# EAGLE design helipad (EAGLE 7.2.0)
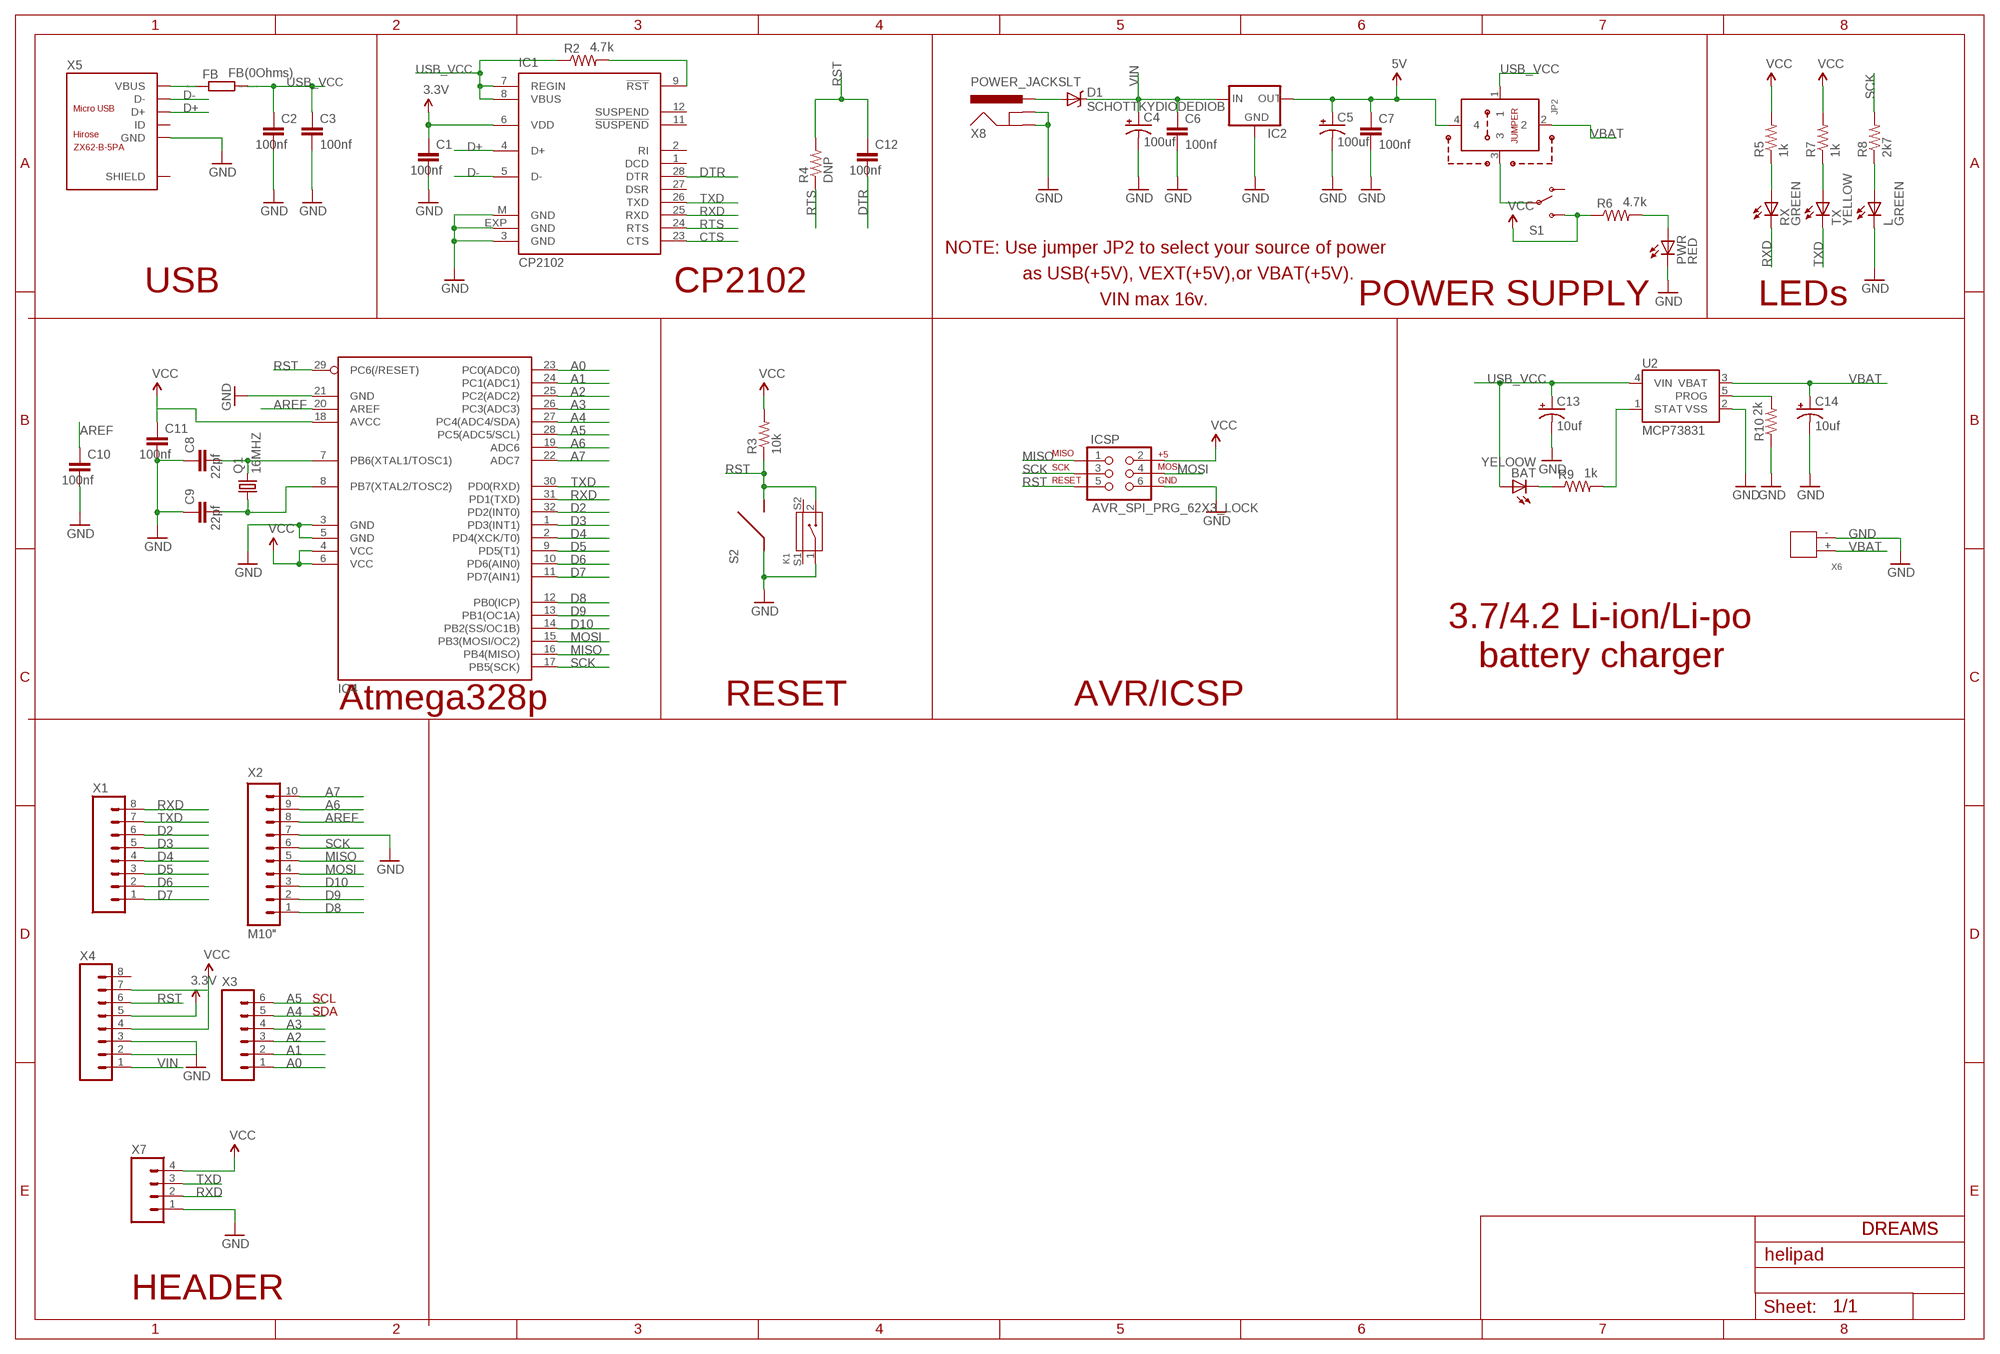
[diagram p0: schematic, sheet 1]

## Parts
BAT  YELOOW  LED1206  [LED-1206]
C1  100nf  CAPACITOR-NONPOLARIZEDSMD  [C0603]
C2  100nf  CAPACITOR-NONPOLARIZEDSMD  [C0603]
C3  100nf  CAPACITOR-NONPOLARIZEDSMD  [C0603]
C4  100uf  CAP_POL7343  [EIA7343]
C5  100uf  CAP_POL7343  [EIA7343]
C6  100nf  CAPACITOR-NONPOLARIZEDSMD  [C0603]
C7  100nf  CAPACITOR-NONPOLARIZEDSMD  [C0603]
C8  22pf  CAPACITOR-NONPOLARIZEDSMD  [C0603]
C9  22pf  CAPACITOR-NONPOLARIZEDSMD  [C0603]
C10  100nf  CAPACITOR-NONPOLARIZEDSMD  [C0603]
C11  100nf  CAPACITOR-NONPOLARIZEDSMD  [C0603]
C12  100nf  CAPACITOR-NONPOLARIZEDSMD  [C0603]
C13  10uf  CAPACITOR_POLARIZED1206  [EIA3216]
C14  10uf  CAPACITOR_POLARIZED1206  [EIA3216]
D1  SCHOTTKYDIODEDIOB  [MINIMELF]
FB  FB(0Ohms)  RR0603  [R0603]
IC1  CP2102  [MLP28]
IC2  V_REG_78XXX  [DPAK]
IC4  MEGA8-TQFP32-AI  [TQFP32-08]
ICSP  AVR_SPI_PRG_62X3_LOCK  [2X3_LOCK]
JP2  JUMPER_3WAY  [JUMPER_3WAY]
K1  SMD-BUTTON-2+2P  [SW4-SMD-7.0X3.5X3.5MM-90D]
L  GREEN  LED1206  [LED-1206]
PWR  RED  LED1206  [LED-1206]
Q1  16MHZ  CRYSTALHC49U-V  [HC49U-V]
R2  4.7k  R-US_R0603  [R0603]
R3  10k  R-US_R0603  [R0603]
R4  DNP  R-US_R0603  [R0603]
R5  1k  R-US_R0603  [R0603]
R6  4.7k  R-US_R0603  [R0603]
R7  1k  R-US_R0603  [R0603]
R8  2k7  R-US_R0603  [R0603]
R9  1k  R-US_R0603  [R0603]
R10  2k  R-US_R0603  [R0603]
RX  GREEN  LED1206  [LED-1206]
S1  SWITCH-SPSTSMD2  [SWITCH-SPDT-SMD]
S2  TACT_SWITCH_SIDE  [TACT-SWITCH_SIDE]
TX  YELLOW  LED1206  [LED-1206]
U2  MCP73831  [SOT23-5]
X1  M08  [1X08]
X2  M10"  [1X10]
X3  M06SIP  [1X06]
X4  M08  [1X08]
X5  MICRO-USB-SMD(ZX62-B-5PA)  [MICRO-USB5+6P-SMD-0.65-AB]
X6  DIP-JST-2P-2.0  [H2-2.0-6X4.5MM]
X7  M04PTH  [1X04]
X8  POWER_JACKSLT  [POWER_JACK_SLOT]

## Nets
3.3V: C1.1 IC1.6(VDD) X4.5
5V: C5.A(+) C7.1 IC2.3(OUT) JP2.4
A0: IC4.23(PC0(ADC0)) X3.1
A1: IC4.24(PC1(ADC1)) X3.2
A2: IC4.25(PC2(ADC2)) X3.3
A3: IC4.26(PC3(ADC3)) X3.4
A4: IC4.27(PC4(ADC4/SDA)) X3.5
A5: IC4.28(PC5(ADC5/SCL)) X3.6
A6: IC4.19(ADC6) X2.9
A7: IC4.22(ADC7) X2.10
AREF: C10.1 X2.8
CTS: IC1.23(CTS)
D2: IC4.32(PD2(INT0)) X1.6
D3: IC4.1(PD3(INT1)) X1.5
D4: IC4.2(PD4(XCK/T0)) X1.4
D5: IC4.9(PD5(T1)) X1.3
D6: IC4.10(PD6(AIN0)) X1.2
D7: IC4.11(PD7(AIN1)) X1.1
D8: IC4.12(PB0(ICP)) X2.1
D9: IC4.13(PB1(OC1A)) X2.2
D10: IC4.14(PB2(SS/OC1B)) X2.3
D+: IC1.4(D+) X5.3(D+)
D-: IC1.5(D-) X5.2(D-)
DTR: C12.2 IC1.28(DTR)
GND: C1.2 C2.2 C3.2 C4.C(-) C5.C(-) C6.2 C7.2 C8.1 C9.1 C10.2 C11.2 C13.C(-) C14.C(-) IC1.3(GND) IC1.EXP(GND) IC1.M(GND) IC2.2(GND) IC4.3(GND) IC4.5(GND) IC4.21(GND) ICSP.6 K1.1 L.C PWR.C R10.1 S2.P$1 U2.2(VSS) X2.7 X4.2 X4.3 X5.5(GND) X6.- X7.1 X8.GND@1(GNDBREAK) X8.GND@2(GND)
MISO: IC4.16(PB4(MISO)) ICSP.1 X2.5
MOSI: IC4.15(PB3(MOSI/OC2)) ICSP.4 X2.4
N$1: D1.A X8.PWR
N$2: IC1.9(!RST) R2.2
N$3: PWR.A R6.2
N$4: JP2.3 S1.2(P)
N$5: R5.1 RX.A
N$6: C8.2 IC4.7(PB6(XTAL1/TOSC1)) Q1.2
N$7: C9.2 IC4.8(PB7(XTAL2/TOSC2)) Q1.1
N$8: R7.1 TX.A
N$9: L.A R8.1
N$11: BAT.C R9.1
N$12: R9.2 U2.1(STAT)
N$14: R10.2 U2.5(PROG)
RST: C12.1 IC4.29(PC6(/RESET)) ICSP.5 K1.2 R3.1 R4.2 S2.P$2 X4.6
RTS: IC1.24(RTS) R4.1
RXD: IC1.25(RXD) IC4.31(PD1(TXD)) RX.C X1.8 X7.2
SCK: IC4.17(PB5(SCK)) ICSP.3 R8.2 X2.6
TXD: IC1.26(TXD) IC4.30(PD0(RXD)) TX.C X1.7 X7.3
USB_VCC: BAT.A C2.1 C3.1 C13.A(+) FB.2 IC1.7(REGIN) IC1.8(VBUS) JP2.1 R2.1 U2.4(VIN)
VBAT: C14.A(+) JP2.2 U2.3(VBAT) X6.+
VBUS: FB.1 X5.1(VBUS)
VCC: C11.1 IC4.4(VCC) IC4.6(VCC) IC4.18(AVCC) ICSP.2 R3.2 R5.2 R6.1 R7.2 S1.3(S) X4.4 X4.7 X7.4
VIN: C4.A(+) C6.1 D1.K(C) IC2.1(IN) X4.1
Unconnected: IC1.1(DCD) IC1.2(RI) IC1.11(!SUSPEND) IC1.12(SUSPEND) IC1.27(DSR) IC4.20(AREF) K1.S1 K1.S2 S1.1(O) X4.8 X5.4(ID) X5.P1(SHIELD) X5.P2(SHIELD) X5.P3(SHIELD) X5.P4(SHIELD) X5.P5(SHIELD) X5.P6(SHIELD)

## Notes on the sheet
- NOTE: Use jumper JP2 to select your source of power
- as USB(+5V), VEXT(+5V),or VBAT(+5V).
- USB | CP2102
- VIN max 16v. | POWER SUPPLY | LEDs
- 3.7/4.2 Li-ion/Li-po
     battery charger
- Atmega328p | RESET | AVR/ICSP
- SCL
- SDA
- DREAMS | DREAMS
- HEADER

## Library data of the parts
BAT L PWR RX TX = Entesla_Kanni:LED: LEDs Standard schematic elements and footprints for 5mm, 3mm, 1206, and 0603 sized LEDs. 5mm - Spark Fun Electronics SKU : COM-00529 (and others)
C1-C3 C6-C12 = Entesla_Kanni:CAPACITOR-NONPOLARIZED: CAPACITOR, European symbol,Non Polarized Capacitors
C4 C5 = SparkFun-Capacitors:CAP_POL: Capacitor Polarized These are standard SMD and PTH capacitors. Normally 10uF, 47uF, and 100uF in electrolytic and tantalum varieties. Always verify the external diameter of the through hole cap, it varies with capacity, voltage, and manufacturer. The EIA devices should be standard.
C13 C14 = Entesla-lib-Aug2010:CAPACITOR_POLARIZED: Capacitor Polarized These are commonly used SMD and PTH capacitors. Verify the external diameter of the through hole, as it may vary with manufacturer.
D1 = Entesla-lib-Aug2010:SCHOTTKYDIODE: SCHOTTKY DIODE
FB = eagle-ltspice:R: RESISTOR, European symbol; SPICEMODEL: NONE; SPICEPREFIX: R
IC1 = silabs:CP210*: Single-Chip USB to UART Bridge Source: www.silabs.com .. CP2101.pdf / cp2102.pdf; MF: FARNELL; MPN: CP2102-GM; OC_FARNELL: 9282130; OC_NEWARK: 30K5635
IC2 = Entesla_Kanni:V_REG_78XX: Voltage Regulator Standard 7805 5V regulator. IGO (Input Ground Output). Spark Fun Electronics SKU : COM-00107
IC4 = Entesla_Kanni:MEGA8-TQFP32: MICROCONTROLLER 8 Kbytes FLASH, 1 kbytes SRAM, 512 bytes EEPROM, USART, 6-channel 10 bit ADC, 2-channel 8 bit ADC Pin compatible with Atmega48, ATMega88, ATMega168 Source: avr.lbr; MPN: ATMEGA8-16AU; OC_FARNELL: 9171371; OC_NEWARK: 73M8863
ICSP = SparkFun-Connectors:AVR_SPI_PRG_6: AVR ISP 6 Pin This is the reduced ISP connector for AVR programming. Common on Arduino. This footprint will take up less PCB space and can be used with a 10-pin to 6-pin adapter such as SKU: BOB-08508 **Special note about "TEST_POINT" package. The stop mask is on the top side, so if you want your programming test points to be on the bottom of your board, make sure to place this package on the bottom side of the board. This also ensure that the orientation to program from the bottom side will be correct.
JP2 = Entesla_Kanni:JUMPER_3WAY
K1 = Seeed-OPL-Button:SMD-BUTTON-2+2P: 311020023; MPN: TS-1188E
Q1 = crystal:CRYSTAL: CRYSTAL; OC_FARNELL: 1666969; OC_NEWARK: unknown
R2-R10 = Entesla_Kanni:R-US_: RESISTOR, American symbol
S1 = Entesla_Kanni:SWITCH-SPST: SPST Switch Simple slide switch. Spark Fun Electronics SKU : COM-00102
S2 = Entesla_Kanni:TACT_SWITCH_SIDE
U2 = SparkFun-PowerIC:MCP73831: Miniature single cell, fully integrated Li-Ion, Li-polymer charge management controller http://ww1.microchip.com/downloads/en/DeviceDoc/21984a.pdf IC-09995; PROD_ID: IC-09995
X1 X4 = Entesla_Kanni:M08: Header 8 Standard 8-pin 0.1" header. Use with straight break away headers (SKU : PRT-00116), right angle break away headers (PRT-00553), swiss pins (PRT-00743), machine pins (PRT-00117), and female headers (PRT-00115).
X2 = Entesla_Kanni:M10: Header 10 Standard 10-pin 0.1" header. Use with straight break away headers (SKU : PRT-00116), right angle break away headers (PRT-00553), swiss pins (PRT-00743), machine pins (PRT-00117), and female headers (PRT-00115).
X3 = Entesla_Kanni:M06: Header 6 Standard 6-pin 0.1" header. Use with straight break away headers (SKU : PRT-00116), right angle break away headers (PRT-00553), swiss pins (PRT-00743), machine pins (PRT-00117), and female headers (PRT-00115). Molex polarized connector foot print use with SKU : PRT-08094 with associated crimp pins and housings. NOTES ON THE VARIANTS LOCK and LOCK_LONGPADS... This footprint was designed to help hold the alignment of a through-hole component (i.e. 6-pin header) while soldering it into place. You may notice that each hole has been shifted either up or down by 0.005 of an inch from it's more standard position (which is a perfectly straight line). This slight alteration caused the pins (the squares in the middle) to touch the edges of the holes. Because they are alternating, it causes a "brace" to hold the component in place. 0.005 has proven to be the perfect amount of "off-center" position when using our standard breakaway headers. Although looks a little odd when you look at the bare footprint, once you have a header in there, the alteration is very hard to notice. Also, if you push a header all the way into place, it is covered up entirely on the bottom side. This idea of altering the position of holes to aid alignment will be further integrated into the Sparkfun Library for other footprints. It can help hold any component with 3 or more connection pins.
X5 = Seeed-OPL-Connector:MICRO-USB-SMD(ZX62-B-5PA): 320010005
X6 = Seeed-OPL-Connector:DIP-JST-2P-2.0: 320110049
X7 = usb:M04: Header 4 Standard 4-pin 0.1" header. Use with straight break away headers (SKU : PRT-00116), right angle break away headers (PRT-00553), swiss pins (PRT-00743), machine pins (PRT-00117), and female headers (PRT-00115). Molex polarized connector foot print use with SKU : PRT-08231 with associated crimp pins and housings.
X8 = SparkFun-Connectors:POWER_JACK: Power Jack This is the standard 5.5mm barrel jack for power. The PTH is the most common, proven, reliable, footprint. The Slot footprint only works if the mill layer is transmitted to the PCB fab house so be warned. Mating wall wart : TOL-00298 (and others); PROD_ID: PRT-00119

## Board
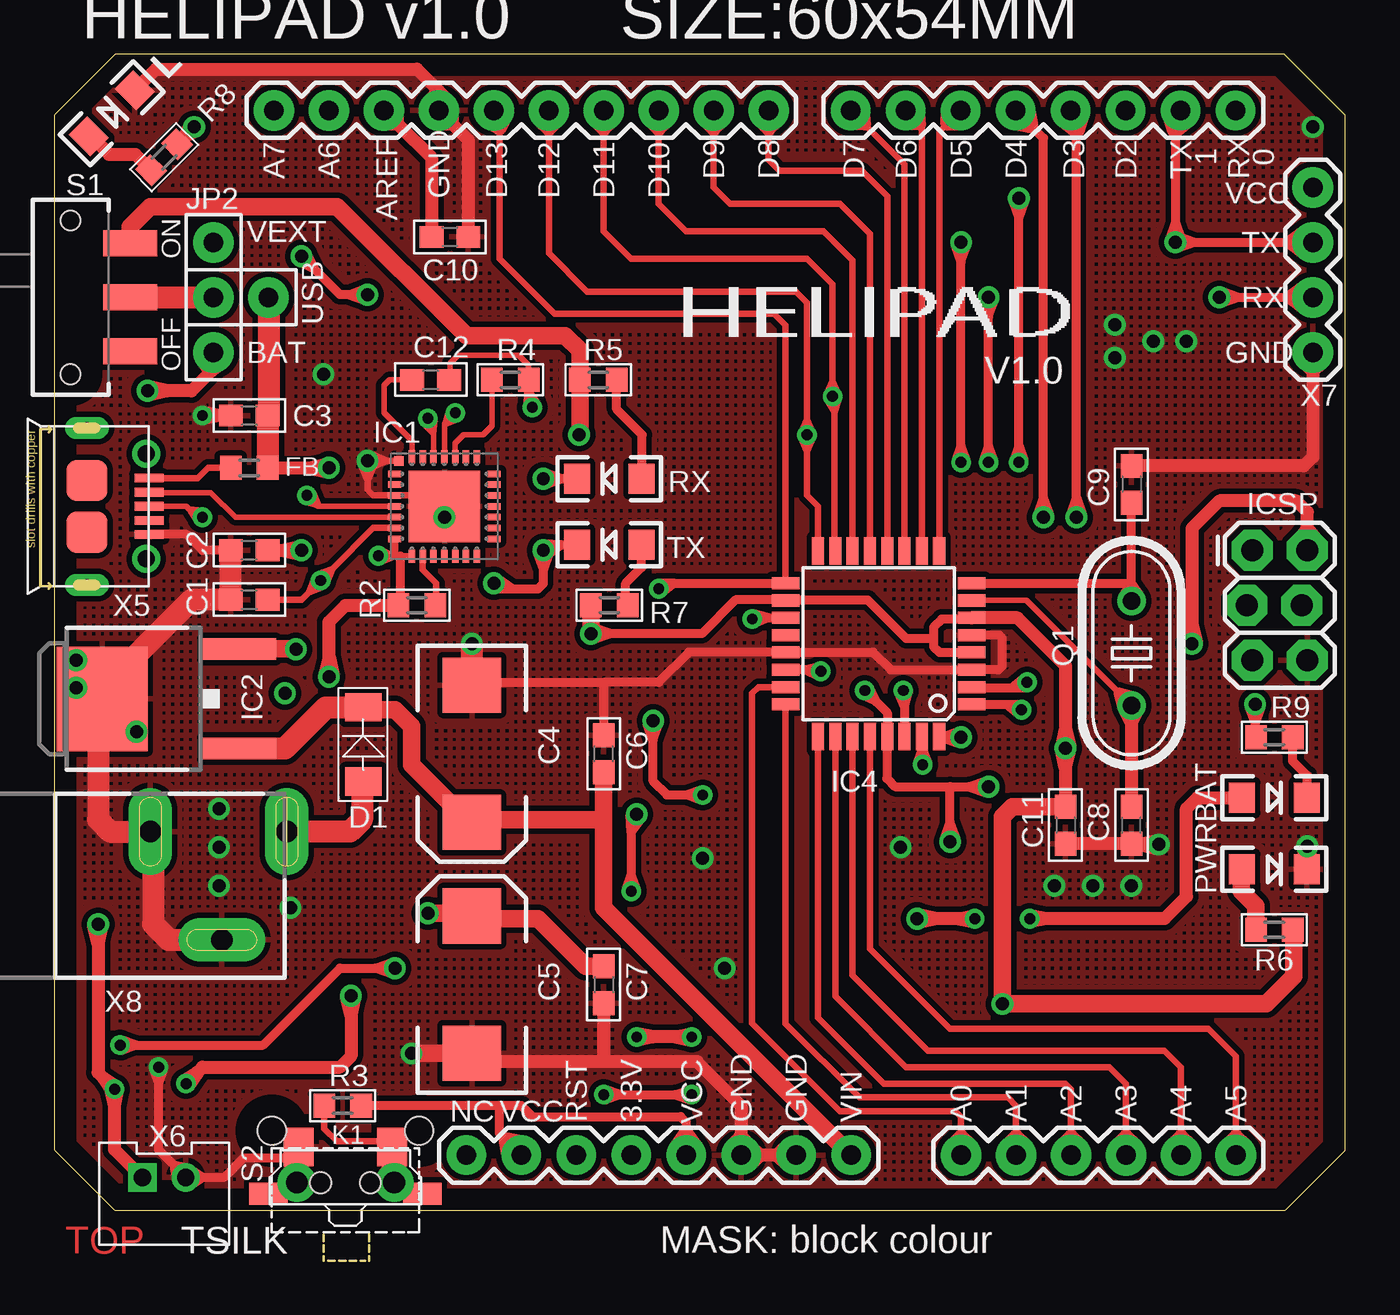
[diagram p1: board, top side]
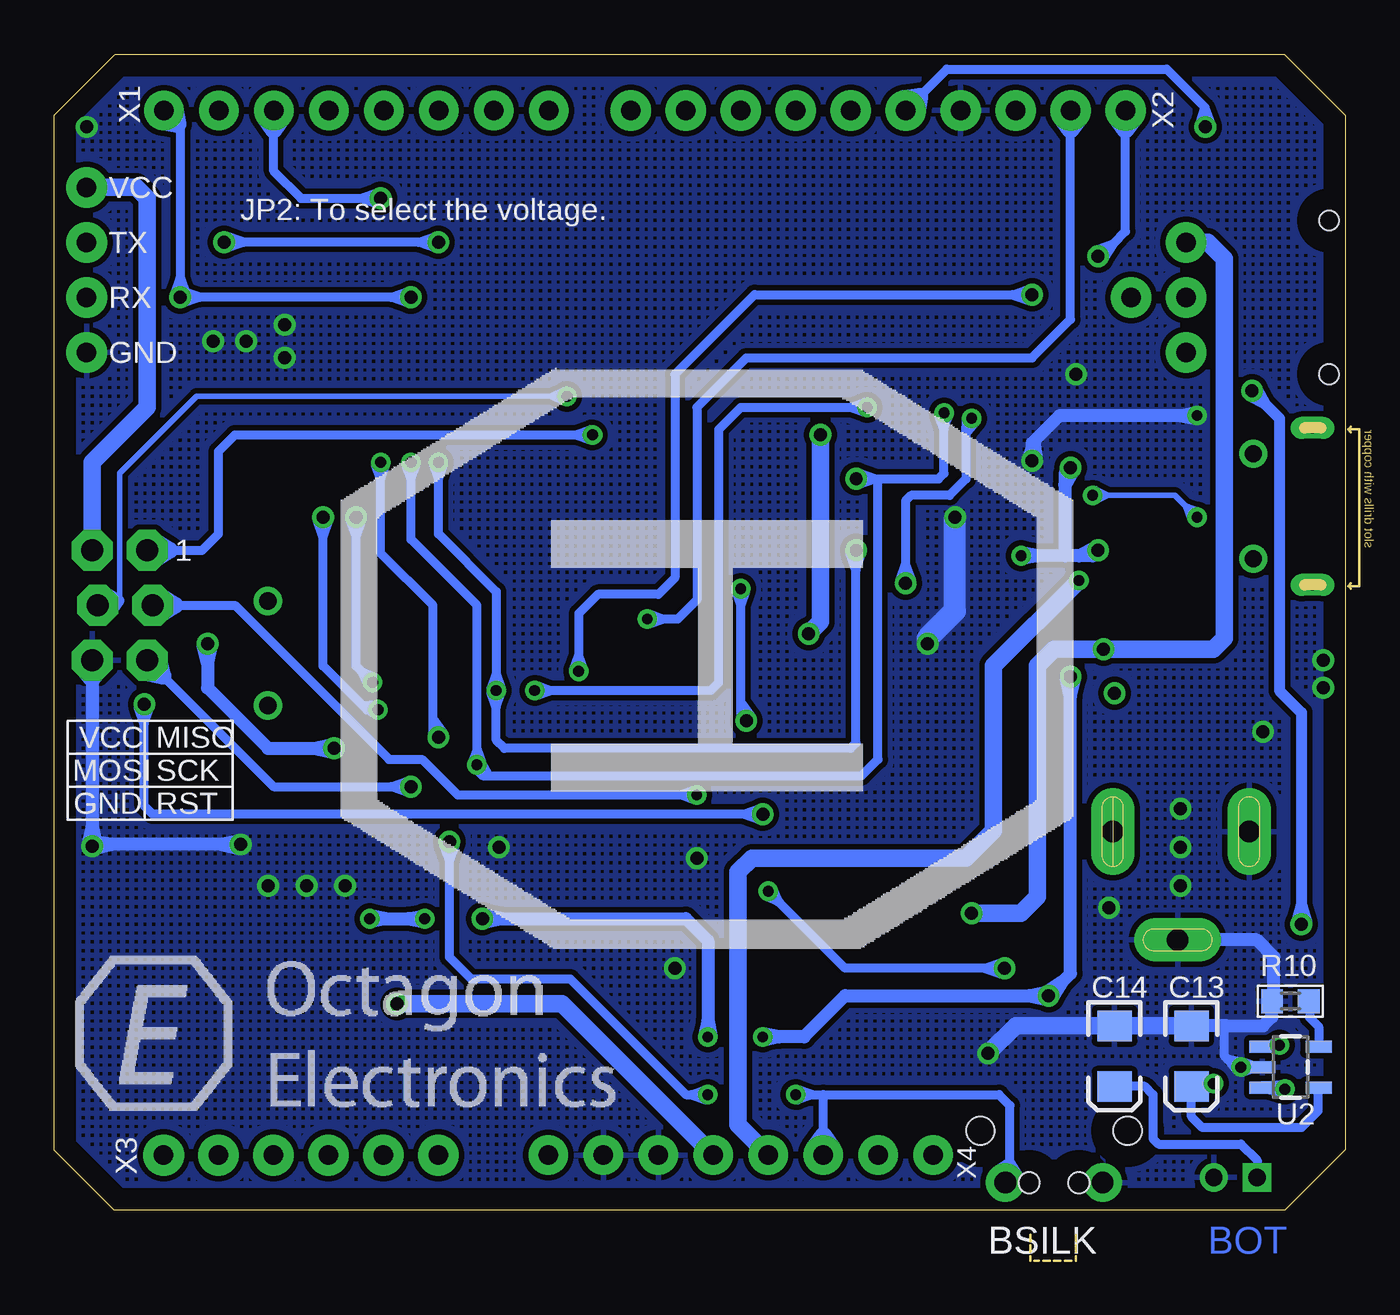
[diagram p2: board, bottom side, seen from below]

Size 59.67 x 53.4 mm. Coordinates in mm from the lower left corner, seen from the top.
Outline: 56.86,53.4 2.83,53.4 0,50.57 0,2.8 2.8,0 56.89,0 59.67,2.78 59.67,50.59 56.86,53.4
Copper layers (1*16): Top 0.035mm / dielectric 1.5mm / Bottom 0.035mm
Design rules "default": minimum track width 10mil, minimum drill 24mil, track to track 8mil, track to pad 8mil, pad to pad 8mil, via to via 8mil, smd to smd 8mil, copper to edge 40mil, drill to drill 8mil, minimum pad ring 10mil, minimum via ring 8mil, stop-mask expansion 4mil, vias tented up to drill 0mil, thermal gap 10mil

### Footprints (pad centres in the part's own frame; a part is rotated, then mirrored left to right if it is on the bottom)
LED-1206 = smd 1.2 x 1.4: A -1.5,0; C 1.5,0
C0603 = smd 1.1 x 1: 1 -0.85,0; 2 0.85,0
EIA7343 = smd 2.55 x 2.7: A 3.17,0; C -3.17,0
EIA3216 = smd 1.4 x 1.6: A 1.4,0; C -1.4,0
MINIMELF = smd 1.3 x 1.7: A 0.749,0.953; K 4.178,0.953
R0603 = smd 1 x 1.1: 1 -0.85,0; 2 0.85,0
MLP28 = smd 0.6 x 0.3: 1 -2.3,1.5; 2 -2.3,1; 3 -2.3,0.5; 4 -2.3,0; 5 -2.3,-0.5; 6 -2.3,-1; 7 -2.3,-1.5; 15 2.3,-1.5; 16 2.3,-1; 17 2.3,-0.5; 18 2.3,0; 19 2.3,0.5; 20 2.3,1; 21 2.3,1.5 | smd 0.3 x 0.6: 8 -1.5,-2.3; 9 -1,-2.3; 10 -0.5,-2.3; 11 0,-2.3; 12 0.5,-2.3; 13 1,-2.3; 14 1.5,-2.3; 22 1.5,2.3; 23 1,2.3; 24 0.5,2.3; 25 0,2.3; 26 -0.5,2.3; 27 -1,2.3; 28 -1.5,2.3 | smd 3.3 x 3.3: EXP 0,0 | smd 0.435 x 0.435: M -2.103,2.103
DPAK = smd 1 x 3.4: 1 -2.3,-4.24; 3 2.3,-4.24 | smd 4.826 x 4.191: 2 0,2.096
TQFP32-08 = smd 1.27 x 0.559: 1 -4.293,2.8; 2 -4.293,2; 3 -4.293,1.2; 4 -4.293,0.4; 5 -4.293,-0.4; 6 -4.293,-1.2; 7 -4.293,-2; 8 -4.293,-2.8; 17 4.293,-2.8; 18 4.293,-2; 19 4.293,-1.2; 20 4.293,-0.4; 21 4.293,0.4; 22 4.293,1.2; 23 4.293,2; 24 4.293,2.8 | smd 0.559 x 1.27: 9 -2.8,-4.293; 10 -2,-4.293; 11 -1.2,-4.293; 12 -0.4,-4.293; 13 0.4,-4.293; 14 1.2,-4.293; 15 2,-4.293; 16 2.8,-4.293; 25 2.8,4.293; 26 2,4.293; 27 1.2,4.293; 28 0.4,4.293; 29 -0.4,4.293; 30 -1.2,4.293; 31 -2,4.293; 32 -2.8,4.293
2X3_LOCK = drill 1.016 pad 1.88 octagon: 1 0,0; 2 0,2.54; 3 2.54,-0.254; 4 2.54,2.286; 5 5.08,0; 6 5.08,2.54
JUMPER_3WAY = drill 0.9 pad 1.88: 1 -1.27,0; 2 1.27,2.54; 3 1.27,0; 4 1.27,-2.54
SW4-SMD-7.0X3.5X3.5MM-90D = smd 1.397 x 1.778: 1 -2.159,1.651; 2 2.159,1.651 | smd 1.778 x 1.016: S1 -3.556,-0.508; S2 3.556,-0.508 | hole 0.95: -1.15,0; 1.15,0
HC49U-V = drill 0.813: 1 -2.413,0; 2 2.413,0
SWITCH-SPDT-SMD = smd 1.2 x 2.5: 1 -2.5,-2.75; 2 0,-2.75; 3 2.5,-2.75 | hole 0.9: -3.55,0; 3.55,0
TACT-SWITCH_SIDE = drill 1 pad 1.778: P$1 -2.25,0; P$2 2.25,0 | hole 1.3: -3.4,2.4; 3.4,2.4
SOT23-5 = smd 0.55 x 1.2: 1 -0.95,-1.3; 2 0,-1.3; 3 0.95,-1.3; 4 0.95,1.3; 5 -0.95,1.3
1X08 = drill 0.9 pad 1.829: 1 0,0; 2 2.54,0; 3 5.08,0; 4 7.62,0; 5 10.16,0; 6 12.7,0; 7 15.24,0; 8 17.78,0
1X10 = drill 0.9 pad 1.88: 1 0,0; 2 2.54,0; 3 5.08,0; 4 7.62,0; 5 10.16,0; 6 12.7,0; 7 15.24,0; 8 17.78,0; 9 20.32,0; 10 22.86,0
1X06 = drill 0.9 pad 1.88: 1 0,0; 2 2.54,0; 3 5.08,0; 4 7.62,0; 5 10.16,0; 6 12.7,0
MICRO-USB5+6P-SMD-0.65-AB = smd 0.4 x 1.35: 1 -1.3,2.875; 2 -0.65,2.875; 3 0,2.875; 4 0.65,2.875; 5 1.3,2.875 | smd 1.9 x 1.9: P1 -1.2,0; P2 1.2,0 | drill 0.508 pad 1.016 long: P3 -3.625,0; P4 3.625,0 | drill 0.8: P5 -2.425,2.73; P6 2.425,2.73
H2-2.0-6X4.5MM = drill 0.8 pad 1.3 square: + -1,0.75 | drill 0.8 pad 1.3: - 1,0.75
1X04 = drill 0.9 pad 1.88: 1 0,0; 2 2.54,0; 3 5.08,0; 4 7.62,0
POWER_JACK_SLOT = drill 1 pad 2 long: GND@1 2.58,7.5; GND@2 7.58,10.8; PWR 2.58,13.8

### Placement (x,y rotation side)
BAT  56.39,19.05 0 top
C1  9.02,28.19 180 top
C2  9.02,30.48 180 top
C3  9.02,36.7 180 top
C4  19.3,21.08 270 top
C5  19.3,10.41 90 top
C6  25.4,21.08 90 top
C7  25.4,10.41 270 top
C8  49.78,17.78 90 top
C9  49.78,33.53 270 top
C10  18.29,44.96 0 top
C11  46.74,17.78 270 top
C12  17.4,38.35 180 top
C13  7.11,7.11 270 bottom
C14  10.67,7.11 270 bottom
D1  15.24,19.05 90 top
FB  9.02,34.29 0 top
IC1  18.03,32.51 0 top
IC2  4.32,23.62 90 top
IC4  38.1,26.16 180 top
ICSP  55.37,30.48 270 top
JP2  8.64,42.16 180 top
K1  13.46,1.27 0 top
L  2.67,50.67 45 top
PWR  56.39,15.75 0 top
Q1  49.78,25.73 270 top
R2  16.76,27.94 0 top
R3  13.34,4.83 0 top
R4  21.08,38.35 0 top
R5  25.15,38.35 180 top
R6  56.39,12.95 180 top
R7  25.65,27.94 180 top
R8  5.08,48.64 45 top
R9  56.39,21.84 180 top
R10  2.54,9.65 0 bottom
RX  25.65,33.78 180 top
S1  0.76,42.16 90 top
S2  13.46,1.27 0 top
TX  25.65,30.73 180 top
U2  2.54,6.6 270 bottom
X1  36.82,50.8 0 top
X2  33.02,50.8 180 top
X3  41.91,2.54 0 top
X4  36.83,2.54 180 top
X5  1.52,32.51 270 top
X6  5.08,0.76 0 top
X7  58.17,39.62 90 top
X8  -3.05,20.07 270 top

### Tracks (layer width: path | path; a pad name or v marks a point on that pad's centre or on a via)
3.3V  (via drill 0.5)
  Top 0.305: C1.1 11.43,28.19 11.79,28.55 | 11.79,28.55 v12.32,29.08 | v12.32,29.08 12.85,29.61 | 12.85,29.61 14.75,31.51 IC1.6 | 11.79,28.55 12.43,28.8 v12.32,29.08 | 11.79,28.55 12.04,29.19 v12.32,29.08 | 12.85,29.61 12.21,29.36 v12.32,29.08 | 12.85,29.61 12.6,28.97 v12.32,29.08
  Bottom 0.813: v12.32,29.08 16.26,25.15 16.26,17.53 17.53,16.26 27.43,16.26 28.07,15.62 28.07,3.94 X4.5
5V  (via drill 0.6)
  Top 0.254: v11.18,25.91 11.16,25.92 | C5.A 19.17,13.72
  Top 0.406: C5.A 19.43,13.46
  Top 0.813: 11.16,25.92 IC2.3 | 19.17,13.72 v17.27,13.72 | 19.43,13.46 22.35,13.46 24.55,11.26 C7.1
  Bottom 0.813: v17.27,13.72 14.99,13.72 14.22,14.48 14.22,25.15 13.46,25.91 v11.18,25.91 6.1,25.91 5.59,26.42 5.59,43.94 6.35,44.7 JP2.4
A0
  Top 0.305: X3.1 41.91,3.44 41.91,4.32 41.66,4.57 36.32,4.57 32.26,8.64 32.26,23.88 32.54,24.16 IC4.23
  Top 0.61: 41.91,3.44 41.46,2.99 X3.1 42.36,2.99 41.91,3.44
A1
  Top 0.305: X3.2 44.45,3.44 44.45,4.83 44.07,5.21 37.21,5.21 33.81,8.61 IC4.24
  Top 0.61: 44.45,3.44 44,2.99 X3.2 44.9,2.99 44.45,3.44
A2
  Top 0.305: X3.3 46.99,3.44 46.99,5.59 46.74,5.84 38.35,5.84 35.3,8.9 IC4.25
  Top 0.61: 46.99,3.44 46.54,2.99 X3.3 47.44,2.99 46.99,3.44
A3
  Top 0.305: X3.4 49.53,3.44 49.53,5.84 48.77,6.6 39.37,6.6 36.1,9.87 IC4.26
  Top 0.61: 49.53,3.44 49.08,2.99 X3.4 49.98,2.99 49.53,3.44
A4
  Top 0.305: X3.5 52.07,3.44 52.07,6.6 51.31,7.37 40.39,7.37 36.9,10.85 IC4.27
  Top 0.61: 52.07,3.44 51.62,2.99 X3.5 52.52,2.99 52.07,3.44
A5
  Top 0.305: X3.6 54.61,3.44 54.61,7.11 53.34,8.38 41.4,8.38 37.7,12.08 IC4.28
  Top 0.61: 54.61,3.44 54.16,2.99 X3.6 55.06,2.99 54.61,3.44
A6  (via drill 0.5)
  Top 0.254: IC4.19 33.75,27.3
  Top 0.406: v32.26,27.3 32.31,27.36 33.01,27.36 | 33.01,27.36 IC4.19 | 33.01,27.36 32.32,27.55 v32.26,27.3 | 33.01,27.36 32.36,27.08 v32.26,27.3
  Bottom 0.406: X2.9 12.7,49.9 12.7,41.15 14.48,39.37 27.69,39.37 29.97,37.08 29.97,28.19 30.86,27.3 31.51,27.3 | 31.51,27.3 v32.26,27.3 | 31.51,27.3 32.17,27.07 v32.26,27.3 | 31.51,27.3 32.17,27.54 v32.26,27.3
  Bottom 0.813: 12.7,49.9 13.13,50.48 X2.9 12.27,50.48 12.7,49.9
A7  (via drill 0.5, 0.6)
  Top 0.254: IC4.22 33.88,24.89
  Top 0.406: v14.48,42.29 13.58,42.29 | 13.58,42.29 13.21,42.29 12.07,43.43 | 12.07,43.43 v11.43,44.07 | v35.43,24.89 35.36,24.96 34.69,24.96 | 34.69,24.96 IC4.22 | 34.69,24.96 35.33,24.66 v35.43,24.89 | 34.69,24.96 35.37,25.13 v35.43,24.89 | 13.58,42.29 14.38,42.01 v14.48,42.29 | 13.58,42.29 14.38,42.57 v14.48,42.29 | 12.07,43.43 11.7,44.2 v11.43,44.07 | 12.07,43.43 11.3,43.8 v11.43,44.07
  Bottom 0.406: 15.38,42.29 27.3,42.29 30.99,38.61 30.99,29.21 31.75,28.45 34.54,28.45 35.43,27.56 35.43,25.64 | 15.38,42.29 v14.48,42.29 | X2.10 10.16,49.9 10.16,45.21 10.73,44.64 | 10.73,44.64 11.3,44.07 v11.43,44.07 | 35.43,25.64 v35.43,24.89 | 35.43,25.64 35.2,24.98 v35.43,24.89 | 35.43,25.64 35.67,24.98 v35.43,24.89 | 15.38,42.29 14.58,42.57 v14.48,42.29 | 15.38,42.29 14.58,42.01 v14.48,42.29 | 10.73,44.64 11.17,43.91 v11.43,44.07 | 10.73,44.64 11.53,44.35 v11.43,44.07
  Bottom 0.813: 10.16,49.9 10.59,50.48 X2.10 9.73,50.48 10.16,49.9
AREF
  Top 0.61: X2.8 15.88,50.16 | 15.88,50.16 17.44,48.6 C10.1 | 15.88,50.16 15.88,50.8 X2.8 | 15.88,50.16 15.24,50.16 X2.8
D2  (via drill 0.5, 0.6)
  Top 0.254: IC4.32 40.92,21.84
  Top 0.406: 40.92,21.84 41.01,21.84 | 41.01,21.84 v41.91,21.84 | v44.58,34.54 44.58,35.29 | 44.58,35.29 44.58,45.84 | 44.58,45.84 v44.58,46.74 | 41.01,21.84 41.81,21.56 v41.91,21.84 | 41.01,21.84 41.81,22.13 v41.91,21.84 | 44.58,35.29 44.34,34.63 v44.58,34.54 | 44.58,35.29 44.81,34.63 v44.58,34.54 | 44.58,45.84 44.86,46.64 v44.58,46.74 | 44.58,45.84 44.29,46.64 v44.58,46.74
  Bottom 0.406: 42.16,22.71 42.16,22.1 v41.91,21.84 | 42.16,22.71 42.16,27.94 44.58,30.35 44.58,33.79 | X1.6 49.52,49.9 49.52,47.99 48.26,46.74 45.48,46.74 | 44.58,33.79 v44.58,34.54 | 45.48,46.74 v44.58,46.74 | 42.16,22.71 41.67,22.02 v41.91,21.84 | 42.16,22.71 42.21,21.86 v41.91,21.84 | 44.58,33.79 44.81,34.46 v44.58,34.54 | 44.58,33.79 44.34,34.46 v44.58,34.54 | 45.48,46.74 44.68,47.02 v44.58,46.74 | 45.48,46.74 44.68,46.45 v44.58,46.74
  Bottom 0.813: 49.52,49.9 49.94,50.51 X1.6 49.1,50.51 49.52,49.9
D3  (via drill 0.5, 0.6)
  Top 0.254: IC4.1
  Top 0.406: v47.24,32 47.24,32.9 | 47.24,32.9 47.24,49.94 47.24,50.53 X1.5 | IC4.1 44,23.37 | 44,23.37 44.45,23.37 v44.7,23.11 | 44,23.37 44.55,22.92 v44.7,23.11 | 44,23.37 44.7,23.36 v44.7,23.11 | 47.24,32.9 46.96,32.1 v47.24,32 | 47.24,32.9 47.53,32.1 v47.24,32
  Top 0.813: 47.24,49.94 47.46,50.65 X1.5 46.66,50.4 47.24,49.94
  Bottom 0.406: v44.7,23.11 45.21,23.11 45.42,23.33 | 45.42,23.33 47.24,25.15 47.24,31.1 | 47.24,31.1 v47.24,32 | 45.42,23.33 44.72,23.36 v44.7,23.11 | 45.42,23.33 44.85,22.91 v44.7,23.11 | 47.24,31.1 47.53,31.9 v47.24,32 | 47.24,31.1 46.96,31.9 v47.24,32
D4  (via drill 0.5, 0.6)
  Top 0.254: IC4.2 42.42,24.13
  Top 0.406: v45.72,32 45.72,32.9 | 45.72,32.9 45.72,49.52 45.07,50.16 X1.4 | 42.42,24.13 44.25,24.13 | 44.25,24.13 44.7,24.13 v44.96,24.38 | 44.25,24.13 44.96,24.13 v44.96,24.38 | 44.25,24.13 44.8,24.58 v44.96,24.38 | 45.72,32.9 45.44,32.1 v45.72,32 | 45.72,32.9 46,32.1 v45.72,32
  Top 0.813: 45.07,50.16 44.94,50.89 X1.4 44.34,50.3 45.07,50.16
  Bottom 0.406: 45.72,31.1 45.72,25.15 45.49,24.91 | 45.72,31.1 v45.72,32 | 45.49,24.91 v44.96,24.38 | 45.49,24.91 44.85,24.61 v44.96,24.38 | 45.49,24.91 45.18,24.28 v44.96,24.38 | 45.72,31.1 46,31.9 v45.72,32 | 45.72,31.1 45.44,31.9 v45.72,32
D5
  Top 0.305: X1.3 41.26,50.16 40.9,49.8 IC4.9
  Top 0.61: 41.26,50.16 41.92,50.19 X1.3 41.29,50.83 41.26,50.16
D6
  Top 0.305: X1.2 39.99,50.16 40.1,50.06 IC4.10
  Top 0.61: 39.99,50.16 39.97,50.83 X1.2 39.33,50.19 39.99,50.16
D7
  Top 0.305: X1.1 37.45,50.16 39.3,48.32 IC4.11
  Top 0.61: 37.45,50.16 37.43,50.83 X1.1 36.79,50.19 37.45,50.16
D8
  Top 0.305: X2.1 33.02,49.9 33.02,48.51 33.53,48.01 37.34,48.01 38.5,46.84 IC4.12
  Top 0.61: 33.02,49.9 33.47,50.35 X2.1 32.57,50.35 33.02,49.9
D9
  Top 0.305: X2.2 30.48,49.9 30.48,47.24 31.24,46.48 36.32,46.48 37.7,45.1 IC4.13
  Top 0.61: 30.48,49.9 30.93,50.35 X2.2 30.03,50.35 30.48,49.9
D10
  Top 0.305: X2.3 27.94,49.9 27.94,46.48 29.21,45.21 35.56,45.21 36.9,43.87 IC4.14
  Top 0.61: 27.94,49.9 28.39,50.35 X2.3 27.49,50.35 27.94,49.9
D+  (via drill 0.5)
  Top 0.254: X5.3 6.1,32.51 6.22,32.39 | 6.22,32.39 6.6,32 v6.86,32 | 12.24,32.51 12.19,32.51 v11.68,33.02 | 12.24,32.51 IC1.4 | 6.22,32.39 6.58,31.83 v6.86,32 | 6.22,32.39 6.89,32.33 v6.86,32 | 12.24,32.51 11.99,33.14 v11.68,33.02 | 12.24,32.51 11.59,32.71 v11.68,33.02
  Bottom 0.254: v6.86,32 7.39,32.53 | 7.39,32.53 7.87,33.02 10.93,33.02 | 10.93,33.02 v11.68,33.02 | 7.39,32.53 6.75,32.31 v6.86,32 | 7.39,32.53 7.17,31.9 v6.86,32 | 10.93,33.02 11.54,32.73 v11.68,33.02 | 10.93,33.02 11.54,33.31 v11.68,33.02
D-
  Top 0.254: X5.2 4.41,33.15 7.24,33.15 8.38,32 IC1.5
DTR
  Top 0.254: C12.2 15.49,38.35 15.24,38.1 15.24,36.83 16.53,35.54 IC1.28
GND  (via drill 0.5, 0.6)
  Top 0.254: IC4.5 42.41,26.54 | IC1.3 | IC4.3 42.45,25.02 | 6.1,1.52 6.1,1.53 6.1,1.52 X6.- | v14.48,34.62 v14.48,34.61
  Top 0.305: 2.22,24.07 IC2.2 2.03,23.43 | X8.GND@1 4.57,17.37 | K1.1 11.21,2.83 11.21,2.41 | 33.83,25.78 IC4.21 33.79,25.78 | v14.48,34.61 15.38,34.61 | 15.38,34.61 IC1.M | v14.48,34.62 14.48,33.72 | 14.48,33.72 14.48,33.27 14.74,33.01 IC1.3 17.53,33.01 | 15.38,34.61 14.62,34.94 v14.48,34.62 | 15.38,34.61 14.61,34.3 v14.48,34.62 | 14.48,33.72 14.8,34.48 v14.48,34.62 | 14.48,33.72 14.15,34.48 v14.48,34.62
  Top 0.406: C2.2 6.86,30.48 6.13,31.21 X5.5 | C5.C 19.43,7.37 | C4.C 19.44,24.38 25.4,24.38 | 25.4,24.38 C6.2 | 33.83,25.78 37.85,25.78 38.66,24.96 IC4.3 43.63,24.96 43.81,25.15 43.81,26.42 43.67,26.56 IC4.5 | 33.79,25.78 29.34,25.78 27.94,24.38 25.4,24.38 | 6.1,1.52 5.53,2.09 | 5.53,2.09 4.83,2.79 4.83,5.85 | 4.83,5.85 v4.83,6.6 | 6.1,1.52 6.88,1.52 | 6.88,1.52 7.87,1.52 8.76,2.41 11.21,2.41 | 4.83,5.85 5.06,6.52 v4.83,6.6 | 4.83,5.85 4.59,6.52 v4.83,6.6 | 5.53,2.09 5.63,1.44 X6.- | 5.53,2.09 6.17,1.95 X6.- | 6.88,1.52 6.33,1.89 X6.- | 6.88,1.52 6.34,1.14 X6.-
  Top 0.61: 11.21,2.41 11.21,2.27 | 11.21,2.27 S2.P$1 | C9.1 57.75,34.38 58.17,34.8 58.17,38.72 | L.C 4.7,52.7 16.76,52.7 17.77,51.7 | 17.77,51.7 17.78,51.69 X2.7 | X4.2 33.39,2.54 | 33.39,2.54 32.65,2.54 | 32.65,2.54 X4.3 | 19.44,24.38 19.3,24.52 | v57.91,16.82 57.89,16.74 57.89,15.91 | 57.89,15.91 PWR.C | 50.15,16.89 49.82,16.89 C8.1 C11.2 | 50.15,16.89 v51.05,16.89 | C5.C 19.69,6.86 25.4,6.86 | 31.75,3.44 31.75,4.83 29.72,6.86 25.4,6.86 | 31.75,3.44 X4.3 | X7.1 58.17,38.72 | C3.2 7.61,36.7 | 7.61,36.7 v6.86,36.7 | C7.2 25.4,6.86 | X2.7 18.42,50.16 | 18.42,50.16 19.14,49.44 C10.2 | 57.89,15.91 58.1,16.77 v57.91,16.82 | 57.89,15.91 57.72,16.78 v57.91,16.82 | 50.15,16.89 51.01,16.7 v51.05,16.89 | 50.15,16.89 51.01,17.09 v51.05,16.89 | 7.61,36.7 6.89,36.85 v6.86,36.7 | 7.61,36.7 6.89,36.56 v6.86,36.7 | 11.21,2.27 10.74,1.61 S2.P$1 | 11.21,2.27 11.69,1.61 S2.P$1 | 17.77,51.7 17.32,51.24 X2.7 | 17.77,51.7 18.23,51.25 X2.7 | 18.42,50.16 18.41,50.8 X2.7 | 18.42,50.16 17.78,50.16 X2.7 | 32.65,2.54 32.16,2.99 X4.3 | 32.65,2.54 32.16,2.09 X4.3 | 31.75,3.44 31.3,2.95 X4.3 | 31.75,3.44 32.2,2.95 X4.3 | 33.39,2.54 33.88,2.09 X4.2 | 33.39,2.54 33.88,2.99 X4.2 | 58.17,38.72 58.62,39.18 X7.1 | 58.17,38.72 57.72,39.18 X7.1
  Top 0.813: C5.C v16.51,7.24
  Top 1.016: C2.2 C1.2 6.35,28.19 2.22,24.07 | 2.03,23.43 2.03,18.03 2.58,17.49 X8.GND@1 | 4.57,17.37 4.57,13.21 5.29,12.49 X8.GND@2 | 19.3,24.52 v19.3,26.16 | v18.03,32 17.53,33.01
  Bottom 0.406: U2.2 4.08,6.6 | 4.08,6.6 v4.83,6.6 | v4.83,6.6 5.08,6.6 5.47,6.99 | 6.99,8.51 C13.C | 5.47,6.99 5.59,7.11 5.59,8.51 | 5.46,8.51 | R10.1 3.3,9.74 | 4.08,6.6 4.74,6.37 v4.83,6.6 | 4.08,6.6 4.74,6.84 v4.83,6.6 | 5.47,6.99 4.78,6.85 v4.83,6.6 | 5.47,6.99 5.02,6.45 v4.83,6.6
  Bottom 0.61: ICSP.6 57.91,24.38 | 57.91,24.38 57.91,17.71 | 57.91,17.71 v57.91,16.82 | v51.05,16.89 51.95,16.89 | 51.95,16.89 57.02,16.89 | 57.02,16.89 57.78,16.89 v57.91,16.82 | 5.46,8.51 5.59,8.51 C13.C | 5.46,8.51 3.81,8.51 3.39,8.93 R10.1 | 3.3,9.74 3.3,11.68 4.1,12.49 X8.GND@2 | v6.86,36.7 7.61,36.7 | 7.61,36.7 13.21,36.7 14.39,35.52 | 14.39,35.52 14.48,35.43 v14.48,34.62 | 57.91,17.71 57.72,16.86 v57.91,16.82 | 57.91,17.71 58.11,16.86 v57.91,16.82 | 57.02,16.89 57.85,16.63 v57.91,16.82 | 57.02,16.89 57.88,17.01 v57.91,16.82 | 51.95,16.89 51.1,17.09 v51.05,16.89 | 51.95,16.89 51.1,16.7 v51.05,16.89 | 7.61,36.7 6.89,36.85 v6.86,36.7 | 7.61,36.7 6.89,36.56 v6.86,36.7 | 14.39,35.52 14.28,34.65 v14.48,34.62 | 14.39,35.52 14.67,34.68 v14.48,34.62 | 57.91,24.38 58.41,25 ICSP.6 | 57.91,24.38 57.42,25 ICSP.6
  Bottom 0.813: C13.C C14.C 15.24,8.51 v16.51,7.24
  Bottom 1.016: v18.03,32 18.03,27.69 19.3,26.42 v19.3,26.16
  other vias: 1.02,25.4 1.02,24.13 3.81,22.1 7.62,18.54 7.62,16.76 7.62,14.99 10.92,13.97 30.99,11.18 29.97,16.26 49.78,14.99 48.01,14.99 46.23,14.99 39.12,16.76 52.32,40.13 50.8,40.13 49.02,40.89 49.02,39.37 58.17,50.04 12.45,38.61
  pour Bottom (isolate 0.254, hatched): 0,0 59.69,0 59.69,53.34 0,53.34
  pour Top (isolate 0.254, hatched): 0,0 59.69,0 59.69,53.34 0,53.34
MISO  (via drill 0.5)
  Top 0.305: X2.5 22.86,49.9 22.86,44.2 24.64,42.42 34.29,42.42 34.79,41.92 34.79,36.56 | 34.79,36.56 v34.79,35.81 | v34.79,35.81 v34.8,35.81 34.8,35.06 | 34.8,35.06 34.8,33.02 35.3,32.52 IC4.16 | 34.79,36.56 34.52,35.94 v34.79,35.81 | 34.79,36.56 35.07,35.94 v34.79,35.81 | 34.8,35.06 35.07,35.7 v34.79,35.81 | 34.8,35.06 34.52,35.69 v34.79,35.81
  Top 0.61: 22.86,49.9 23.31,50.35 X2.5 22.41,50.35 22.86,49.9
  Bottom 0.406: ICSP.1 54.36,30.48 52.83,30.48 52.07,31.24 52.07,35.05 51.31,35.81 35.54,35.81 | 35.54,35.81 v34.79,35.81 | 35.54,35.81 34.88,36.05 v34.79,35.81 | 35.54,35.81 34.88,35.58 v34.79,35.81
  Bottom 0.813: 54.36,30.48 55.09,30.03 ICSP.1 55.09,30.93 54.36,30.48
MOSI  (via drill 0.5)
  Top 0.305: X2.4 25.4,49.9 25.4,45.21 26.67,43.94 34.8,43.94 35.97,42.77 35.97,38.34 | 35.97,38.34 v35.97,37.59 | IC4.15 36.07,30.49 36.07,36.85 | 36.07,36.85 36.07,37.5 v35.97,37.59 | 35.97,38.34 35.7,37.71 v35.97,37.59 | 35.97,38.34 36.25,37.71 v35.97,37.59 | 36.07,36.85 36.26,37.51 v35.97,37.59 | 36.07,36.85 35.72,37.44 v35.97,37.59
  Top 0.61: 25.4,49.9 25.85,50.35 X2.4 24.95,50.35 25.4,49.9
  Bottom 0.254: ICSP.4 56.9,27.94 56.67,28.17 56.64,28.19 56.64,34.04 53.09,37.59 36.72,37.59 | 36.72,37.59 v35.97,37.59 | 36.72,37.59 36.12,37.89 v35.97,37.59 | 36.72,37.59 36.12,37.3 v35.97,37.59
  Bottom 0.508: 56.67,28.17 57.09,27.55 ICSP.4 57.32,28.54 56.67,28.17
N$1
  Top 0.406: D1.A 14.22,19.74
  Top 1.016: 14.22,19.74 14.22,18.03 13.68,17.49 X8.PWR
N$2
  Top 0.305: R2.2 17.65,27.98 17.65,28.96 17.03,29.57 IC1.9
N$3
  Top 0.406: PWR.A 54.86,15.72
  Top 0.813: 54.86,15.72 54.86,14.73 55.54,14.06 R6.2
N$4
  Top 1.016: S1.2 JP2.3
N$5
  Top 0.254: RX.A 27.18,33.81
  Top 0.406: 27.18,33.81 27.18,35.81 26,37 R5.1
N$6
  Top 0.254: Q1.2 49.21,23.89 44.94,28.16 IC4.7
  Top 0.508: 49.21,23.89 49.39,23.21 Q1.2 49.89,23.71 49.21,23.89
  Top 0.61: Q1.2 49.78,22.5 | 49.78,22.5 C8.2 | 49.78,22.5 50.1,23.16 Q1.2 | 49.78,22.5 49.46,23.16 Q1.2
N$7
  Top 0.254: IC4.8
  Top 0.406: Q1.1 49.78,28.96 | 49.78,28.96 | 49.78,28.96 C9.2 | IC4.8 49.78,28.96 | 49.78,28.96 49.41,28.4 Q1.1 | 49.78,28.96 50.16,28.4 Q1.1
N$8
  Top 0.305: R7.1 26.42,28.03
  Top 0.406: 26.42,28.03 26.42,28.96 27.15,29.69 TX.A
N$9
  Top 0.254: L.A 1.7,49.61
  Top 0.61: 1.7,49.61 2.54,48.77 3.75,48.77 R8.1
N$11
  Top 0.305: BAT.C 57.91,19.07
  Top 0.406: 57.91,19.07 57.91,20.07 57.24,20.74 R9.1
N$12  (via drill 0.5, 0.6)
  Top 0.406: v3.05,7.62 3.8,7.62 | 3.8,7.62 9.65,7.62 13.21,11.18 14.85,11.18 | 14.85,11.18 v15.75,11.18 | R9.2 55.5,21.88 55.5,22.47 | 55.5,22.47 v55.5,23.37 | v26.92,18.29 26.67,18.03 26.67,17.43 | 26.67,17.43 26.67,15.48 | 26.67,15.48 v26.67,14.73 | 3.8,7.62 3.13,7.86 v3.05,7.62 | 3.8,7.62 3.13,7.38 v3.05,7.62 | 14.85,11.18 15.65,10.89 v15.75,11.18 | 14.85,11.18 15.65,11.46 v15.75,11.18 | 26.67,15.48 26.43,14.81 v26.67,14.73 | 26.67,15.48 26.91,14.81 v26.67,14.73 | 26.67,17.43 27.17,18.11 v26.92,18.29 | 26.67,17.43 26.62,18.27 v26.92,18.29 | 55.5,22.47 55.78,23.27 v55.5,23.37 | 55.5,22.47 55.22,23.27 v55.5,23.37
  Bottom 0.254: U2.1 3.8,7.6 | 3.8,7.6 3.77,7.62 v3.05,7.62 | 3.8,7.6 3.2,7.91 v3.05,7.62 | 3.8,7.6 3.18,7.32 v3.05,7.62
  Bottom 0.406: v26.92,18.29 27.82,18.29 | 27.82,18.29 55.12,18.29 55.5,18.67 55.5,22.47 | v15.75,11.18 16.65,11.18 | 16.65,11.18 23.11,11.18 26.14,14.2 | 55.5,22.47 v55.5,23.37 | 26.14,14.2 v26.67,14.73 | 16.65,11.18 15.85,11.46 v15.75,11.18 | 16.65,11.18 15.85,10.89 v15.75,11.18 | 26.14,14.2 26.78,14.51 v26.67,14.73 | 26.14,14.2 26.44,14.84 v26.67,14.73 | 27.82,18.29 27.02,18.57 v26.92,18.29 | 27.82,18.29 27.02,18 v26.92,18.29 | 55.5,22.47 55.78,23.27 v55.5,23.37 | 55.5,22.47 55.22,23.27 v55.5,23.37
N$14
  Bottom 0.406: R10.2 1.65,9.61 1.65,8.89 1.24,8.48 U2.5
N$17  (via drill 0.6)
  other vias: 10.67,23.88
RST  (via drill 0.5, 0.6)
  Top 0.254: 38.48,21.89 IC4.29 38.48,21.85 | C12.1 18.29,38.39 18.29,39.12 18.67,39.5 21.46,39.5 21.93,39.03 R4.2
  Top 0.305: 15.71,2.83 K1.2 15.37,3.17 13.08,3.17 12.48,3.77 R3.1
  Top 0.406: v25.4,5.33 26.15,5.33 | 26.15,5.33 28.71,5.33 | 28.71,5.33 v29.46,5.33 | v41.4,17.02 41.4,17.92 | 41.4,17.92 41.4,19.56 | 38.48,21.85 38.48,19.94 38.86,19.56 41.4,19.56 | 41.4,19.56 42.28,19.56 | 42.28,19.56 v43.18,19.56 | v22.1,37.08 21.93,37.25 21.93,37.81 | 21.93,37.81 R4.2 | v37.47,24 37.99,23.47 | 37.99,23.47 38.5,22.97 IC4.29 | 42.28,19.56 43.08,19.27 v43.18,19.56 | 42.28,19.56 43.08,19.84 v43.18,19.56 | 37.99,23.47 37.69,24.11 v37.47,24 | 37.99,23.47 37.36,23.78 v37.47,24 | 21.93,37.81 21.85,37.11 v22.1,37.08 | 21.93,37.81 22.31,37.22 v22.1,37.08 | 26.15,5.33 25.48,5.57 v25.4,5.33 | 26.15,5.33 25.48,5.1 v25.4,5.33 | 28.71,5.33 29.38,5.1 v29.46,5.33 | 28.71,5.33 29.38,5.57 v29.46,5.33 | 41.4,17.92 41.12,17.12 v41.4,17.02 | 41.4,17.92 41.69,17.12 v41.4,17.02
  Top 0.61: 15.71,2.83 15.71,2.27 | 15.71,2.27 S2.P$2 | 15.71,2.27 15.24,1.61 S2.P$2 | 15.71,2.27 16.19,1.61 S2.P$2
  Bottom 0.406: ICSP.5 54.65,24.68 49.53,19.56 44.08,19.56 | 41.4,16.12 41.4,11.68 40.39,10.67 35.81,10.67 30.48,5.33 30.21,5.33 | 41.4,16.12 v41.4,17.02 | S2.P$2 15.49,1.49 15.49,2.25 | 15.49,2.25 15.49,4.83 16,5.33 24.13,5.33 | 36.72,24 29.34,24 28.96,24.38 28.96,36.07 27.94,37.08 22.85,37.08 | 36.72,24 v37.47,24 | 44.08,19.56 v43.18,19.56 | 22.85,37.08 v22.1,37.08 | 30.21,5.33 v29.46,5.33 | v25.4,5.33 24.65,5.33 | 24.65,5.33 24.13,5.33 | X4.6 24.13,3.44 24.13,5.33 | 44.08,19.56 43.28,19.84 v43.18,19.56 | 44.08,19.56 43.28,19.27 v43.18,19.56 | 36.72,24 37.38,23.77 v37.47,24 | 36.72,24 37.38,24.24 v37.47,24 | 22.85,37.08 22.18,37.32 v22.1,37.08 | 22.85,37.08 22.18,36.85 v22.1,37.08 | 24.65,5.33 25.32,5.1 v25.4,5.33 | 24.65,5.33 25.32,5.57 v25.4,5.33 | 30.21,5.33 29.55,5.57 v29.46,5.33 | 30.21,5.33 29.55,5.1 v29.46,5.33 | 41.4,16.12 41.69,16.92 v41.4,17.02 | 41.4,16.12 41.12,16.92 v41.4,17.02 | 15.49,2.25 15.12,1.62 S2.P$2 | 15.49,2.25 16.1,1.84 S2.P$2
  Bottom 0.813: 54.65,24.68 55.49,24.88 ICSP.5 54.85,25.52 54.65,24.68 | 24.13,3.44 23.71,2.83 X4.6 24.55,2.83 24.13,3.44
RTS
  Top 0.254: IC1.24 18.53,35.42 18.92,35.81 19.81,35.81 20.23,36.23 R4.1
  Top 0.305: IC1.24 18.54,34.82
RXD  (via drill 0.5, 0.6)
  Top 0.254: IC4.31 40.13,21.84 | IC1.25 18.03,36.28 | 18.03,36.28 18.03,36.32 v18.54,36.83 | 18.03,36.28 18.66,36.53 v18.54,36.83 | 18.03,36.28 18.23,36.92 v18.54,36.83
  Top 0.406: RX.C 23.51,33.78 | 23.51,33.78 v22.61,33.78 | 40.13,21.84 40.13,21.32 | 40.13,21.32 v40.13,20.57 | v43.18,34.54 43.18,35.29 | 43.18,35.29 43.18,41.26 | 43.18,41.26 v43.18,42.16 | v53.85,42.16 54.75,42.16 | 54.75,42.16 57.27,42.16 X7.2 | 23.51,33.78 22.71,34.06 v22.61,33.78 | 23.51,33.78 22.71,33.5 v22.61,33.78 | 40.13,21.32 39.9,20.66 v40.13,20.57 | 40.13,21.32 40.37,20.66 v40.13,20.57 | 43.18,35.29 42.94,34.63 v43.18,34.54 | 43.18,35.29 43.42,34.63 v43.18,34.54 | 43.18,41.26 43.46,42.06 v43.18,42.16 | 43.18,41.26 42.9,42.06 v43.18,42.16 | 54.75,42.16 53.95,42.45 v53.85,42.16 | 54.75,42.16 53.95,41.88 v53.85,42.16
  Top 0.813: 57.27,42.16 57.85,41.73 X7.2 57.85,42.59 57.27,42.16
  Bottom 0.406: v22.61,33.78 21.71,33.78 | 21.71,33.78 21.59,33.78 | 21.59,33.78 18.8,33.78 18.54,34.04 18.54,36.08 | v40.13,20.57 40.13,20.32 39.88,20.07 39.58,20.07 | 39.58,20.07 22.35,20.07 21.59,20.83 21.59,33.78 | v40.13,20.57 40.13,21.32 | 40.13,21.32 40.13,27.94 43.18,30.99 43.18,33.79 | 18.54,36.08 v18.54,36.83 | 43.18,33.79 v43.18,34.54 | X1.8 53.96,50.16 53.85,50.05 53.85,43.06 | 53.85,43.06 v53.85,42.16 | v43.18,42.16 44.08,42.16 | 44.08,42.16 52.95,42.16 | 52.95,42.16 v53.85,42.16 | 21.71,33.78 22.51,33.5 v22.61,33.78 | 21.71,33.78 22.51,34.06 v22.61,33.78 | 18.54,36.08 18.78,36.75 v18.54,36.83 | 18.54,36.08 18.31,36.75 v18.54,36.83 | 39.58,20.07 40.23,20.34 v40.13,20.57 | 39.58,20.07 39.91,20.69 v40.13,20.57 | 40.13,21.32 39.9,20.66 v40.13,20.57 | 40.13,21.32 40.37,20.66 v40.13,20.57 | 43.18,33.79 43.42,34.46 v43.18,34.54 | 43.18,33.79 42.94,34.46 v43.18,34.54 | 44.08,42.16 43.28,42.45 v43.18,42.16 | 44.08,42.16 43.28,41.88 v43.18,42.16 | 53.85,43.06 53.56,42.26 v53.85,42.16 | 53.85,43.06 54.13,42.26 v53.85,42.16 | 52.95,42.16 53.75,41.88 v53.85,42.16 | 52.95,42.16 53.75,42.45 v53.85,42.16
  Bottom 0.813: 53.96,50.16 54.69,50.3 X1.8 54.1,50.89 53.96,50.16
SCK  (via drill 0.5, 0.6)
  Top 0.305: X2.6 20.57,50.55 20.57,49.94 20.57,43.94 23.11,41.4 33.27,41.4 33.81,40.87 IC4.17
  Top 0.406: 27.69,21.71 27.69,19.81 28.32,19.18 29.22,19.18 | 27.69,21.71 v27.69,22.61 | 28.64,28.96 28.2,28.96 v27.94,28.7 | 28.64,28.96 IC4.17 | 29.22,19.18 v29.97,19.18 | v6.48,50.04 5.84,49.4 | 5.84,49.4 R8.2 | 5.84,49.4 6.61,49.77 v6.48,50.04 | 5.84,49.4 6.21,50.17 v6.48,50.04 | 29.22,19.18 29.89,18.94 v29.97,19.18 | 29.22,19.18 29.89,19.41 v29.97,19.18 | 27.69,21.71 27.97,22.51 v27.69,22.61 | 27.69,21.71 27.4,22.51 v27.69,22.61 | 28.64,28.96 27.94,28.95 v27.94,28.7 | 28.64,28.96 28.1,28.51 v27.94,28.7
  Top 0.61: 20.57,49.94 20.88,50.5 X2.6 20.02,50.24 20.57,49.94
  Bottom 0.406: X2.6 19.68,51.44 18.41,52.7 8.26,52.7 6.49,50.94 | v6.48,50.04 6.48,50.93 6.49,50.94 | ICSP.3 54.1,27.94 51.31,27.94 44.2,20.83 42.67,20.83 41.02,19.18 30.72,19.18 | v27.69,22.61 27.94,22.86 27.94,23.47 | 27.94,23.47 27.94,27.95 | 27.94,27.95 v27.94,28.7 | 30.72,19.18 v29.97,19.18 | 6.49,50.94 6.2,50.14 v6.48,50.04 | 6.49,50.94 6.76,50.13 v6.48,50.04 | 30.72,19.18 30.05,19.41 v29.97,19.18 | 30.72,19.18 30.05,18.94 v29.97,19.18 | 27.94,23.47 27.44,22.78 v27.69,22.61 | 27.94,23.47 27.99,22.62 v27.69,22.61 | 27.94,27.95 28.18,28.62 v27.94,28.7 | 27.94,27.95 27.7,28.62 v27.94,28.7
  Bottom 0.813: 54.1,27.94 54.84,27.49 ICSP.3 54.84,28.39 54.1,27.94 | 19.68,51.44 19.79,50.72 X2.6 20.4,51.33 19.68,51.44
TXD  (via drill 0.5, 0.6)
  Top 0.254: IC4.30 39.24,21.93 | IC1.26 17.53,35.87 | 17.53,35.87 17.53,36.32 v17.27,36.58 | 17.53,35.87 17.6,36.54 v17.27,36.58 | 17.53,35.87 17.04,36.34 v17.27,36.58
  Top 0.406: v22.61,30.48 22.86,30.73 23.47,30.73 | 23.47,30.73 TX.C | 22.61,29.58 22.61,28.96 22.35,28.7 21.18,28.7 | 22.61,29.58 v22.61,30.48 | v20.32,28.96 20.57,28.7 21.18,28.7 | v41.91,34.54 41.91,35.29 | 41.91,35.29 41.91,43.8 | 41.91,43.8 v41.91,44.7 | v39.24,24 39.3,23.95 39.3,23.25 | 39.3,23.25 IC4.30 | v51.82,44.7 52.72,44.7 | 52.72,44.7 57.27,44.7 X7.3 | X1.7 51.82,50.56 51.82,49.93 51.82,45.6 | 51.82,45.6 v51.82,44.7 | 39.3,23.25 39.48,23.94 v39.24,24 | 39.3,23.25 39.01,23.9 v39.24,24 | 23.47,30.73 22.62,30.78 v22.61,30.48 | 23.47,30.73 22.78,30.24 v22.61,30.48 | 22.61,29.58 22.89,30.38 v22.61,30.48 | 22.61,29.58 22.32,30.38 v22.61,30.48 | 21.18,28.7 20.5,29.2 v20.32,28.96 | 21.18,28.7 20.34,28.66 v20.32,28.96 | 41.91,35.29 41.67,34.63 v41.91,34.54 | 41.91,35.29 42.15,34.63 v41.91,34.54 | 41.91,43.8 42.19,44.6 v41.91,44.7 | 41.91,43.8 41.63,44.6 v41.91,44.7 | 52.72,44.7 51.92,44.99 v51.82,44.7 | 52.72,44.7 51.92,44.42 v51.82,44.7 | 51.82,45.6 51.53,44.8 v51.82,44.7 | 51.82,45.6 52.1,44.8 v51.82,44.7
  Top 0.813: 51.82,49.93 52.38,50.41 X1.7 51.58,50.64 51.82,49.93 | 57.27,44.7 57.85,44.27 X7.3 57.85,45.13 57.27,44.7
  Bottom 0.406: 22.61,29.58 22.61,21.59 22.86,21.34 38.86,21.34 39.24,21.72 39.24,23.25 | 22.61,29.58 v22.61,30.48 | 17.53,35.87 17.53,36.32 v17.27,36.58 | 17.53,35.87 17.53,33.78 18.29,33.02 20.07,33.02 20.32,32.77 20.32,29.86 | 20.32,29.86 v20.32,28.96 | 39.24,23.25 v39.24,24 | 41.91,33.79 41.91,31.24 39.24,28.57 39.24,24.75 | 41.91,33.79 v41.91,34.54 | 39.24,24.75 v39.24,24 | v41.91,44.7 42.81,44.7 | 42.81,44.7 50.92,44.7 | 50.92,44.7 v51.82,44.7 | 39.24,23.25 39.48,23.92 v39.24,24 | 39.24,23.25 39.01,23.92 v39.24,24 | 39.24,24.75 39.01,24.09 v39.24,24 | 39.24,24.75 39.48,24.09 v39.24,24 | 22.61,29.58 22.89,30.38 v22.61,30.48 | 22.61,29.58 22.32,30.38 v22.61,30.48 | 17.53,35.87 17.52,36.58 v17.27,36.58 | 17.53,35.87 17.08,36.42 v17.27,36.58 | 20.32,29.86 20.04,29.06 v20.32,28.96 | 20.32,29.86 20.6,29.06 v20.32,28.96 | 41.91,33.79 42.15,34.46 v41.91,34.54 | 41.91,33.79 41.67,34.46 v41.91,34.54 | 42.81,44.7 42.01,44.99 v41.91,44.7 | 42.81,44.7 42.01,44.42 v41.91,44.7 | 50.92,44.7 51.72,44.42 v51.82,44.7 | 50.92,44.7 51.72,44.99 v51.82,44.7
USB_VCC  (via drill 0.5, 0.6)
  Top 0.305: R2.1 15.88,27.98 16,28.11 | 16.02,30.21 IC1.8 16,30.21 15.75,30.21 | v14.99,30.23 15,30.21 15.74,30.21 | 15.74,30.21 15.75,30.21 | IC1.7 15.75,31 15.75,30.21 | 15.74,30.21 15.11,30.5 v14.99,30.23 | 15.74,30.21 15.1,29.95 v14.99,30.23
  Top 0.406: 9.91,36.74 C3.1 | 16,28.11 16,30.21
  Top 0.61: C2.1 10.53,30.48 | 10.53,30.48 v11.43,30.48 | FB.2 11.8,34.29 | 11.8,34.29 v12.7,34.29 | v13.72,9.91 13.72,9.01 | 13.72,9.01 13.72,7.11 13.21,6.6 6.86,6.6 6.63,6.37 | 45.84,13.46 51.31,13.46 52.32,14.48 52.32,18.54 52.83,19.05 BAT.A | 45.84,13.46 v45.09,13.46 | v42.55,13.46 41.8,13.46 | 41.8,13.46 40.78,13.46 | 40.78,13.46 v39.88,13.46 | v29.46,8 28.71,8 | 28.71,8 27.67,8 | 27.67,8 v26.92,8 | v12.7,24.64 12.7,25.54 | 12.7,25.54 12.7,27.18 13.46,27.94 R2.1 | v6.1,5.84 6.63,6.37 | 10.53,30.48 11.39,30.29 v11.43,30.48 | 10.53,30.48 11.39,30.67 v11.43,30.48 | 11.8,34.29 12.66,34.1 v12.7,34.29 | 11.8,34.29 12.66,34.48 v12.7,34.29 | 13.72,9.01 13.91,9.86 v13.72,9.91 | 13.72,9.01 13.52,9.86 v13.72,9.91 | 6.63,6.37 6.01,5.97 v6.1,5.84 | 6.63,6.37 6.22,5.76 v6.1,5.84 | 45.84,13.46 45.11,13.61 v45.09,13.46 | 45.84,13.46 45.11,13.32 v45.09,13.46 | 41.8,13.46 42.52,13.32 v42.55,13.46 | 41.8,13.46 42.52,13.61 v42.55,13.46 | 40.78,13.46 39.92,13.66 v39.88,13.46 | 40.78,13.46 39.92,13.27 v39.88,13.46 | 28.71,8 29.43,7.86 v29.46,8 | 28.71,8 29.43,8.15 v29.46,8 | 27.67,8 26.95,8.15 v26.92,8 | 27.67,8 26.95,7.86 v26.92,8 | 12.7,25.54 12.51,24.68 v12.7,24.64 | 12.7,25.54 12.89,24.68 v12.7,24.64
  Top 1.016: JP2.1 9.91,36.74 | C3.1 FB.2
  Bottom 0.406: U2.4 1.27,5.62 1.27,4.57 2.03,3.81 6.6,3.81 7.11,4.32 C13.A
  Bottom 0.61: v11.43,30.48 11.68,30.23 12.29,30.23 | 12.29,30.23 12.95,30.23 | 12.95,30.23 14.24,30.23 | 14.24,30.23 v14.99,30.23 | v12.7,34.29 12.95,34.04 12.95,33.43 | 12.95,33.43 12.95,30.23 | v6.1,5.84 6.23,5.71 6.83,5.71 | 6.83,5.71 C13.A | v45.09,13.46 44.34,13.46 | 44.34,13.46 43.3,13.46 | 43.3,13.46 v42.55,13.46 | v39.88,13.46 38.98,13.46 | 38.98,13.46 30.48,13.46 29.46,12.45 29.46,8.75 | 14.62,9.91 23.11,9.91 25.02,8 26.17,8 | 14.62,9.91 v13.72,9.91 | 12.7,23.74 12.7,10.92 13.08,10.54 | 12.7,23.74 v12.7,24.64 | 13.08,10.54 v13.72,9.91 | 29.46,8.75 v29.46,8 | 26.17,8 v26.92,8 | 12.29,30.23 11.53,30.65 v11.43,30.48 | 12.29,30.23 11.42,30.28 v11.43,30.48 | 14.24,30.23 14.96,30.08 v14.99,30.23 | 14.24,30.23 14.96,30.37 v14.99,30.23 | 12.95,33.43 12.9,34.3 v12.7,34.29 | 12.95,33.43 12.53,34.19 v12.7,34.29 | 14.62,9.91 13.76,10.1 v13.72,9.91 | 14.62,9.91 13.76,9.71 v13.72,9.91 | 13.08,10.54 13.55,9.8 v13.72,9.91 | 13.08,10.54 13.82,10.07 v13.72,9.91 | 6.83,5.71 6.15,5.98 v6.1,5.84 | 6.83,5.71 6.1,5.69 v6.1,5.84 | 44.34,13.46 45.06,13.32 v45.09,13.46 | 44.34,13.46 45.06,13.61 v45.09,13.46 | 43.3,13.46 42.57,13.61 v42.55,13.46 | 43.3,13.46 42.57,13.32 v42.55,13.46 | 38.98,13.46 39.83,13.27 v39.88,13.46 | 38.98,13.46 39.83,13.66 v39.88,13.46 | 29.46,8.75 29.32,8.03 v29.46,8 | 29.46,8.75 29.61,8.03 v29.46,8 | 26.17,8 26.89,7.86 v26.92,8 | 26.17,8 26.89,8.15 v26.92,8 | 12.7,23.74 12.89,24.59 v12.7,24.64 | 12.7,23.74 12.51,24.59 v12.7,24.64
VBAT  (via drill 0.5, 0.6)
  Top 0.61: v2.03,13.21 2.03,12.31 | 2.03,12.31 2.03,6.35 2.26,6.12 | 2.26,6.12 v2.79,5.59 | X6.+ 2.79,2.8 2.79,4.84 | 2.79,4.84 v2.79,5.59 | JP2.2 7.37,38.86 7.24,38.73 | 7.24,38.73 6.35,37.85 5.22,37.85 | 5.22,37.85 v4.32,37.85 | 5.22,37.85 4.36,38.04 v4.32,37.85 | 5.22,37.85 4.36,37.65 v4.32,37.85 | 2.03,12.31 2.23,13.16 v2.03,13.21 | 2.03,12.31 1.84,13.16 v2.03,13.21 | 2.26,6.12 2.67,5.51 v2.79,5.59 | 2.26,6.12 2.88,5.71 v2.79,5.59 | 2.79,4.84 2.94,5.56 v2.79,5.59 | 2.79,4.84 2.65,5.56 v2.79,5.59 | 7.24,38.73 7.75,39.12 JP2.2 | 7.24,38.73 6.86,39.24 JP2.2
  Bottom 0.254: v2.79,5.59 2.86,5.65 | C14.A 10.54,5.59
  Bottom 0.406: U2.3 3.81,5.62 | X6.+ 4.08,2.3 4.83,3.05 8.64,3.05 8.89,3.3 8.89,5.33 9.27,5.71 C14.A
  Bottom 0.508: v4.32,37.85 3.68,37.21 | 3.68,37.21 3.05,36.58 3.05,24 2.03,22.99 2.03,14.11 | 2.03,14.11 v2.03,13.21 | 3.68,37.21 4.44,37.63 v4.32,37.85 | 3.68,37.21 4.1,37.97 v4.32,37.85 | 2.03,14.11 1.79,13.28 v2.03,13.21 | 2.03,14.11 2.27,13.28 v2.03,13.21
  Bottom 0.61: 2.86,5.65 3.54,5.65 | 3.54,5.65 U2.3 | 3.54,5.65 2.81,5.74 v2.79,5.59 2.84,5.45 3.54,5.65
VBUS
  Top 0.305: FB.1 7.11,34.29 6.63,33.81 X5.1
VCC  (via drill 0.6)
  Top 0.254: IC4.6 42.46,27.43
  Top 0.305: 33.84,28.19 IC4.18 33.77,28.19
  Top 0.406: IC4.6 42.34,27.3 41.02,27.3 40.64,26.92 40.64,26.42 | 40.64,26.42 40.64,26.04 40.91,25.76 IC4.4 | 33.77,28.19 31.5,28.19 29.93,26.63 25.7,26.63 | R6.1 57.28,12.91 | v43.81,9.53 44.58,9.53 | 25.7,26.63 v24.8,26.63 | 33.84,28.19 37.59,28.19 39.37,26.42 40.64,26.42 | 20.57,4.83 21.59,4.83 22.1,4.32 28.96,4.32 29.21,4.06 29.21,3.44 X4.4 | 20.57,4.83 R3.2 | X4.7 20.95,3.18 20.57,3.56 20.57,4.83 | 25.7,26.63 24.9,26.91 v24.8,26.63 | 25.7,26.63 24.9,26.35 v24.8,26.63
  Top 0.61: v46.74,21.34 46.74,20.44 | 46.74,20.44 C11.1 | ICSP.2 57.91,31.5 | 57.91,31.5 57.91,32.26 57.4,32.77 53.85,32.77 52.58,31.5 52.58,27.06 | 52.58,27.06 v52.58,26.16 | IC4.6 44.52,27.36 46.74,25.15 46.74,22.24 | 46.74,22.24 v46.74,21.34 | 52.58,27.06 52.38,26.21 v52.58,26.16 | 52.58,27.06 52.77,26.21 v52.58,26.16 | 46.74,20.44 46.93,21.29 v46.74,21.34 | 46.74,20.44 46.54,21.29 v46.74,21.34 | 46.74,22.24 46.54,21.38 v46.74,21.34 | 46.74,22.24 46.93,21.38 v46.74,21.34 | 57.91,31.5 57.42,30.88 ICSP.2 | 57.91,31.5 58.41,30.88 ICSP.2
  Top 0.813: v24.8,26.63 R7.2 | 57.28,12.91 57.28,10.79 56.01,9.53 v43.81,9.53 43.81,18.16 44.28,18.63 C11.1 | S1.3 3.51,45.42 4.45,46.35 13.08,46.35 19.05,40.39 23.62,40.39 24.3,39.71 R5.2 24.3,35.85 v24.26,35.81 | 20.95,3.18 21.09,2.45 X4.7 21.68,3.04 20.95,3.18 | 29.21,3.44 28.79,2.83 X4.4 29.63,2.83 29.21,3.44
  Bottom 0.61: v52.58,26.16 52.58,25.26 | 52.58,25.26 52.58,24.13 49.78,21.34 47.64,21.34 | 47.64,21.34 v46.74,21.34 | 52.58,25.26 52.77,26.12 v52.58,26.16 | 52.58,25.26 52.38,26.12 v52.58,26.16 | 47.64,21.34 46.78,21.53 v46.74,21.34 | 47.64,21.34 46.78,21.14 v46.74,21.34
  Bottom 0.813: ICSP.2 57.91,34.54 55.37,37.08 55.37,46.74 55.88,47.24 X7.4 | X4.4 36.2,9.53 v43.81,9.53 | v24.8,26.63 24.26,27.18 v24.26,35.81
VIN
  Top 0.305: IC2.1 8.57,21.34
  Top 0.406: 19.43,18.03 C4.A 19.17,17.91 | D1.K 14.4,23.11
  Top 0.813: 25.4,18.03 25.4,13.97 X4.1 | 25.4,18.03 C6.1 | 19.43,18.03 25.4,18.03 | 19.17,17.91 16.51,20.57 16.51,21.84 16.51,22.35 15.75,23.11 14.4,23.11
  Top 1.016: 8.57,21.34 10.67,21.34 12.56,23.23 D1.K

### Text on the board
Top: TOP
Bottom: BOT
tPlace: HELIPAD v1.0 | SIZE:60x54MM | A7 | A6 | D9 | D8 | D7 | D6 | D5 | D4 | D3 | D2 | TX | 1 | RX | 0 | GND | D13 | D12 | D11 | D10 | AREF | VCC | VEXT | ON | TX | RX | USB | OFF | BAT | GND | V1.0 | NC | VCC | RST | 3.3V | VCC | GND | GND | VIN | A0 | A1 | A2 | A3 | A4 | A5 | TSILK | MASK: block colour
bPlace: VCC | JP2: To select the voltage. | TX | RX | GND | MISO | VCC | SCK | MOSI | RST | GND | BSILK
bNames: 1
tStop: OCT00002 | TSTOP
bStop: OCT00002 | BSTOP